# Altium schematic sheet 44.SchDoc
size 513 x 386 mm
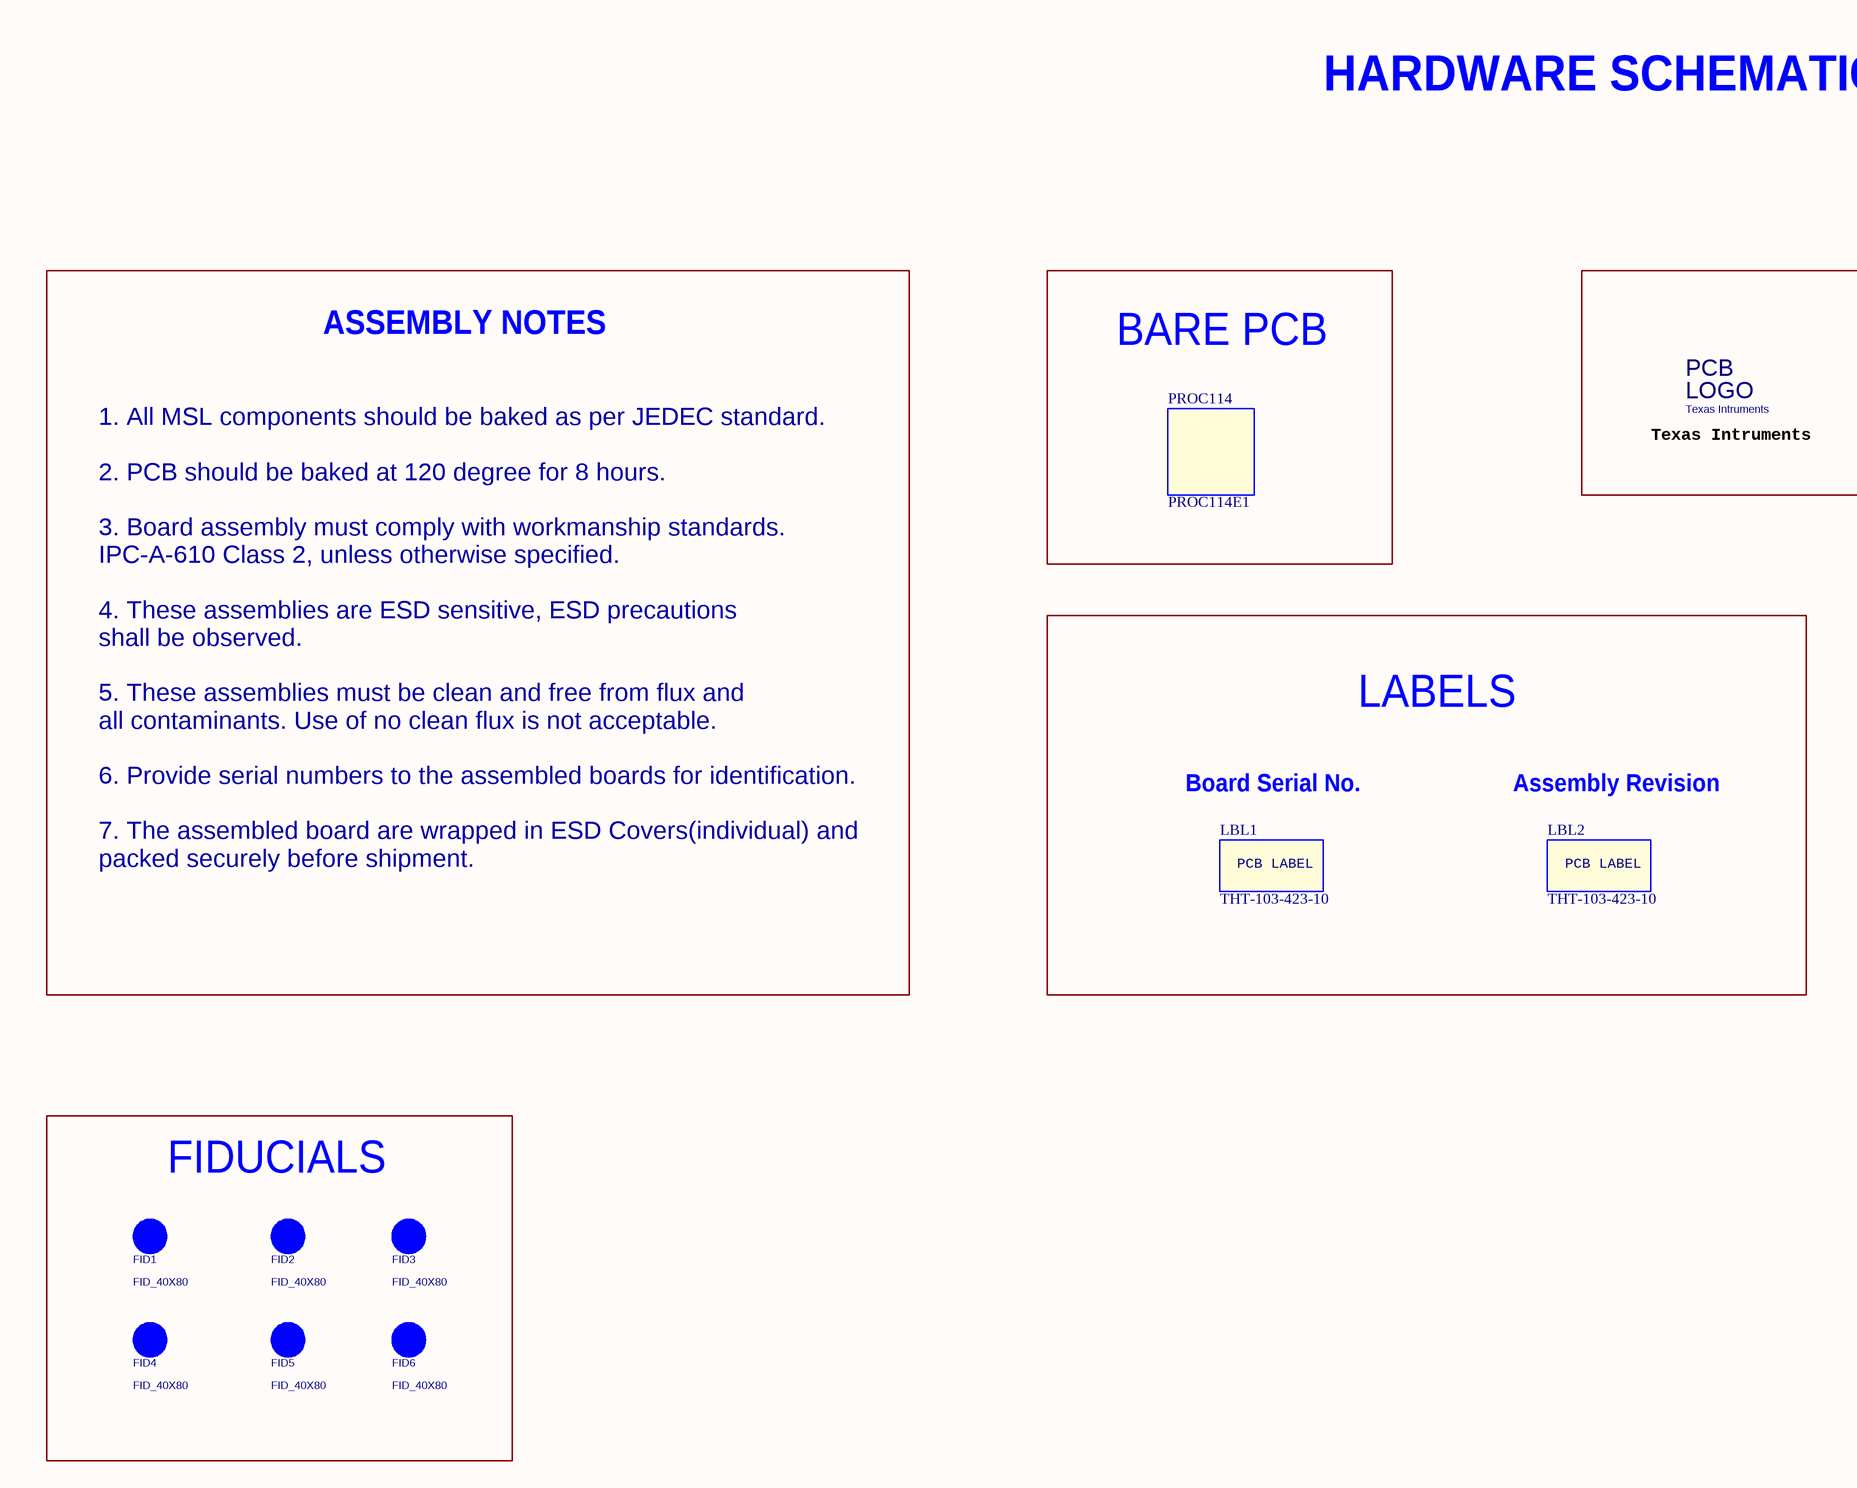
[diagram p0: 44.SchDoc, top left]
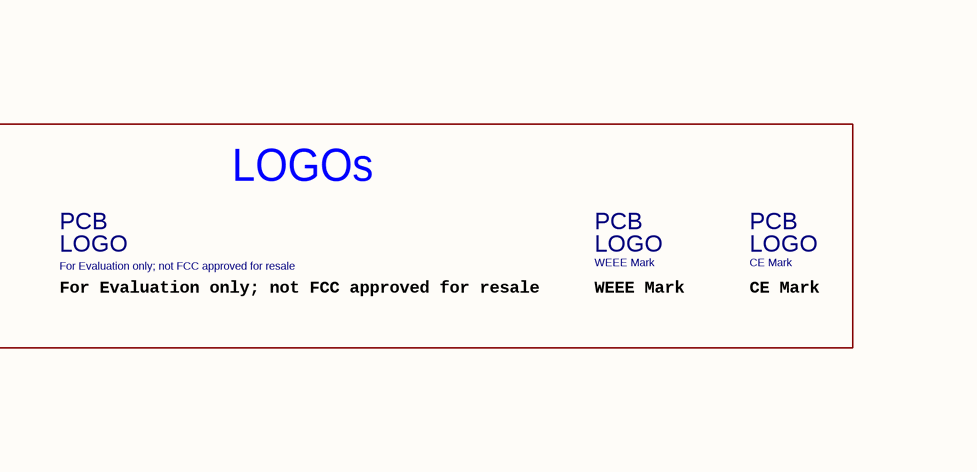
[diagram p1: 44.SchDoc, top right]
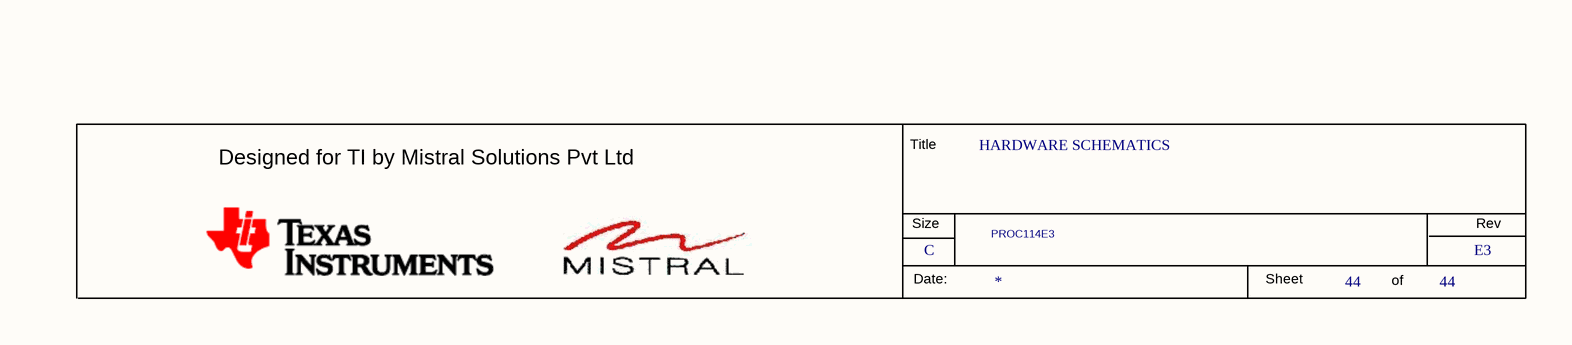
[diagram p2: 44.SchDoc, bottom right]

## Parts
*  RevCode: E3  Title: HARDWARE SCHEMATICS  Page Size: C  Page Number: 44  Variant Name: PROC114E3  (hidden comment: MISTRAL_TITLEBLK_CSIZE)  (graphical)
FID1  FID_40X80  [Fiducial10-20]
FID2  FID_40X80  [Fiducial10-20]
FID3  FID_40X80  [Fiducial10-20]
FID4  FID_40X80  [Fiducial10-20]
FID5  FID_40X80  [Fiducial10-20]
FID6  FID_40X80  [Fiducial10-20]
LBL1  THT-103-423-10  [NA]
LBL2  THT-103-423-10  [NA]
LOGO1  Texas Intruments  [TI_Stacked_Overlay_Small]
LOGO2  For Evaluation only; not FCC approved for resale  [FCC_disclaimer]
LOGO3  WEEE Mark  [TI_Stacked_Overlay_Small]
LOGO4  CE Mark  [TI_Stacked_Overlay_Small]
PCB1  PROC114  Mfr_part_number: PROC114E1

## Blocks framed on the sheet
BARE PCB: PCB1
LOGOs: LOGO1-LOGO4
LABELS: LBL1 LBL2
FIDUCIALS: FID1-FID6

## Notes on the sheet
- HARDWARE SCHEMATICS
- 1. All MSL components should be baked as per JEDEC standard.
  2. PCB should be baked at 120 degree for 8 hours.
  3. Board assembly must comply with workmanship standards.
  IPC-A-610 Class 2, unless otherwise specified.
  4. These assemblies are ESD sensitive, ESD precautions
  shall be observed.
  5. These assemblies must be clean and free from flux and
  all contaminants. Use of no clean flux is not acceptable.
  6. Provide serial numbers to the assembled boards for identification.
  7. The assembled board are wrapped in ESD Covers(individual) and
  packed securely before shipment.
- ASSEMBLY NOTES
- Texas Intruments
- For Evaluation only; not FCC approved for resale
- WEEE Mark
- CE Mark
- (near LBL1) Board Serial No.
- (near LBL2) Assembly Revision
- (in symbol ACCESSORY_THT-3-423-10) PCB LABEL
- (in symbol FCC_disclaimer) PCB; LOGO
- (in symbol MISTRAL_TITLEBLK_CSIZE) Title; Designed for TI by Mistral Solutions Pvt Ltd; Size; Rev; Date:; Sheet; of
- (in symbol TI_Logo) PCB; LOGO
- (in symbol TI_Logo_Dup1) PCB; LOGO

## Library data of the parts
* = MISTRAL_TITLEBLK_CSIZE: Issue: 1.0; Page Create Date: March  8, 1995; Page Count: 44; Page Modify Date: *; Schematic Page Count: 44; Schematic Page Number: 44
FID1-FID6 = Fiducial: PCB Footprint: FID_40X80
LBL1 LBL2 = ACCESSORY_THT-3-423-10: ACCESSORIE 1 WORKHORSE POLYSTER LABLE 0.25" X 1"; Part_type: ACCESSORIES; Mfr_name: BRADY; Mistral Part No: 160018020185; Project: TI_MAXIE_CPB; PCB Footprint: NA; Footprint Path: Y:\MIS_DATABASE\Library\ALTIUM_TOOL\PCB_FOOTPRINTS\Altium_Footprint_Lib.PcbLib; Library Path: Y:\MIS_DATABASE\Library\ALTIUM_TOOL\SCHEMATICS_PARTS\MS_MECHANICAL_Library.schlib; MECHANICAL 3D STEP FILE: NA; Chkd/date: MANIRAJA/270218; Crtd /date: ALVY/260218; Datasheet: NA; Temperature: NA; Weight: NA; Height: NA; Footprint Ref: NA; Library Ref: ACCESSORY_THT-3-423-10; Distributor_part_number: NA; Distributor_name: NA; Package: NA; Wattage: NA; Voltage: NA; Tolerance: NA; Mfr_part_number: THT-103-423-10
LOGO1 LOGO3 = TI_Logo_Dup1
LOGO2 = FCC_disclaimer: PCB Footprint: FCC_disclaimer
LOGO4 = TI_Logo: PCB Footprint: TI_Stacked_Overlay_Small
PCB1 = PCB: AM64x EVM Bare PCB; Part_type: ACCESSORIES; Mistral Part No: FY201506000101